# Altium project OPENMV4_wd.PrjPcb
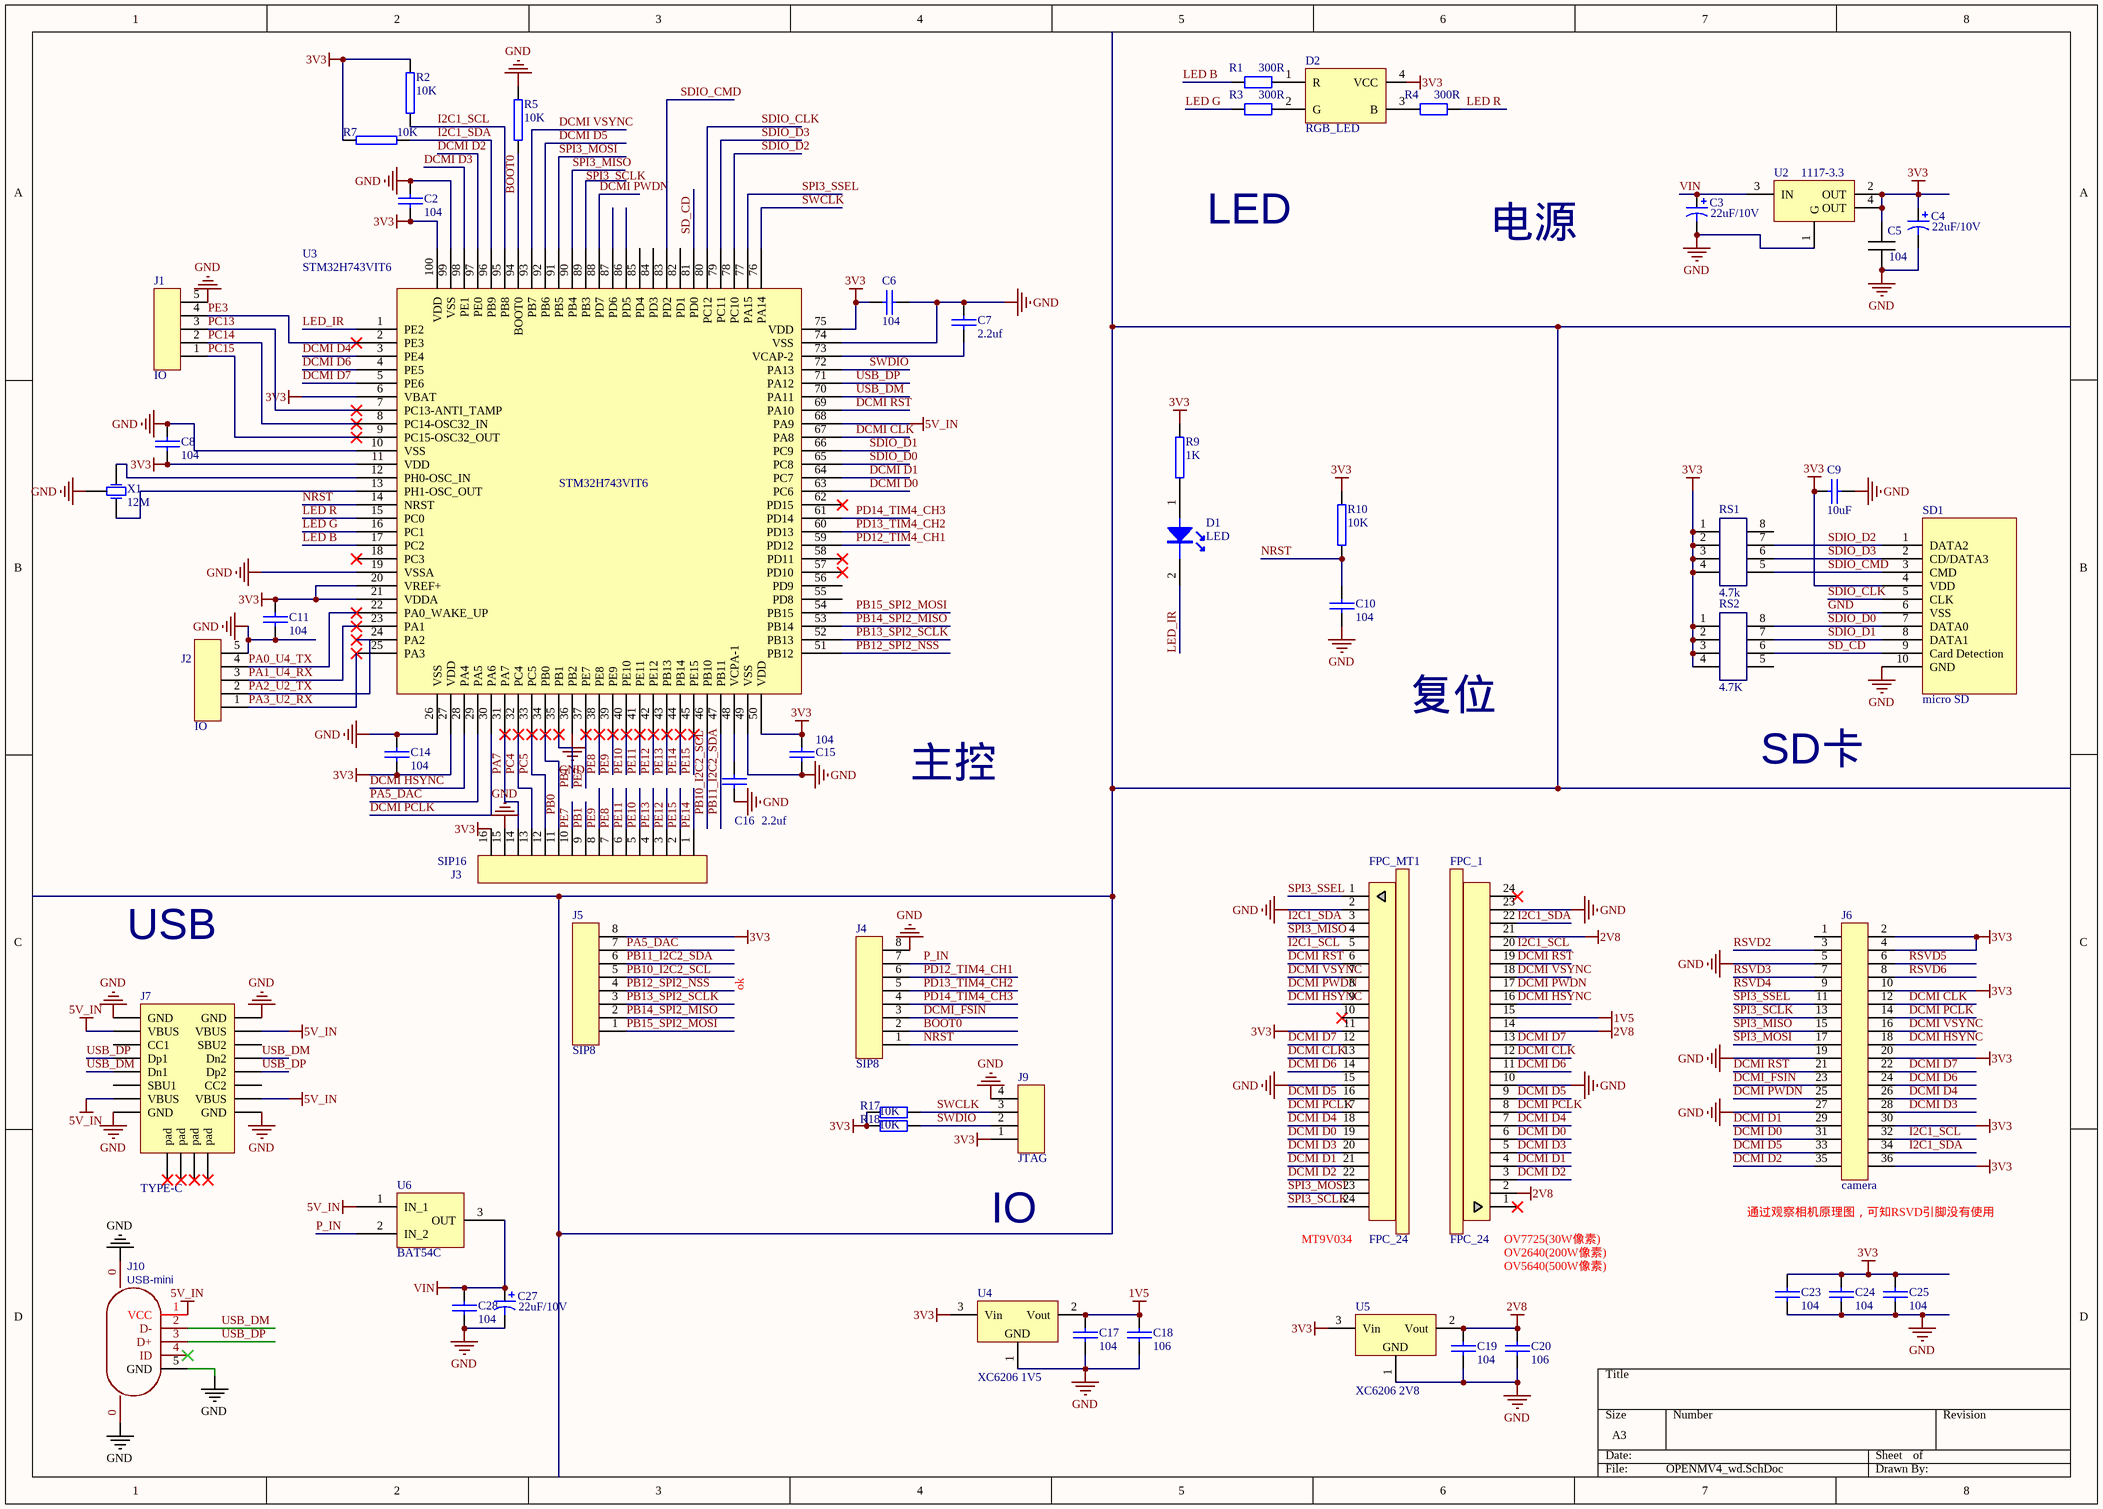
[diagram p0: OPENMV4_wd.SchDoc]
1 sheet, 54 parts. Net scope: global (net labels, ports and power ports of the same name join across sheets).
Board file: openmv4_wd.PcbDoc

## Sheet OPENMV4_wd.SchDoc
size A3

### Parts
C2  104  [0805C]
C3  value 22uF/10V  [1210]  (hidden comment: 47uF)
C4  value 22uF/10V  [1210]  (hidden comment: 47uF)
C5  104  [0805C]
C6  104  [0805C]
C7  2.2uf  [0805C]
C8  104  [0805C]
C9  10uF  [LC-0805_C]
C10  104  [0805C]
C11  104  [0805C]
C14  104  [0805C]
C15  104  [0805C]
C16  2.2uf  [0805C]
C17  104  [0805C]
C18  106  [0805C]
C19  104  [0805C]
C20  106  [0805C]
C23  104  [0805C]
C24  104  [0805C]
C25  104  [0805C]
C27  value 22uF/10V  [1210]  (hidden comment: 47uF)
C28  104  [0805C]
D1  LED  [0805D]
D2  RGB_LED  [LED_3528_RGB]
FPC_1  FPC_24  [FPC_24]
FPC_MT1  FPC_24  [FPC_24]
J1  IO  [SIP5]
J2  IO  [SIP5]
J3  SIP16  [IDC16]
J4  SIP8  [sip8]
J5  SIP8  [sip8]
J6  camera  [DF12-36-DS]
J7  TYPE-C  [USB Type-C-16Pin_A]
J9  JTAG  [SIP4-1]
J10  USB-mini  [USB-MINI]
R1  value 300R  [0805R]  (hidden comment: 1K)
R2  10K  [0805R]
R3  value 300R  [0805R]  (hidden comment: 1K)
R4  value 300R  [0805R]  (hidden comment: 1K)
R5  10K  [0805R]
R7  10K  [0805R]
R9  1K  [0805R]
R10  10K  [0805R]
R17  10K  [0805R]
R18  10K  [0805R]
RS1  4.7k  [0603*4]
RS2  4.7K  [0603*4]
SD1  micro SD  [TF卡座]
U2  1117-3.3  [SOT223]
U3  STM32H743VIT6  [LQFP100 14x14_N]
U4  XC6206 1V5  [SOT23-3N]
U5  XC6206 2V8  [SOT23-3N]
U6  BAT54C  [SOT23-3N]
X1  12M  [XTAL-3215-3P]

### Nets
1V5: C17.1 C18.1 FPC_1.15 U4.2(Vout)
2V8: C19.1 C20.1 FPC_1.2 FPC_1.14 FPC_1.21 U5.2(Vout)
3V3: C2.2 C4.1 C5.2 C6.2 C8.2 C9.2 C11.1 C14.2 C15.2 C23.1 C24.1 C25.1 D2.4(VCC) FPC_MT1.11 J3.16 J5.8 J6.2 J6.4 J6.10 J6.20 J6.30 J6.36 J9.1 R2.2 R7.1 R9.1 R10.1 R17.2 R18.2 RS1.1 RS1.2 RS1.3 RS1.4 RS2.1 RS2.2 RS2.3 RS2.4 SD1.4(VDD) U2.2(OUT) U2.4(OUT) U3.6(VBAT) U3.11(VDD) U3.20(VREF+) U3.21(VDDA) U3.27(VDD) U3.50(VDD) U3.75(VDD) U3.100(VDD) U4.3(Vin) U5.3(Vin)
5V_IN: J7.A4(VBUS) J7.A9(VBUS) J7.B4(VBUS) J7.B9(VBUS) J10.1(VCC) U3.68(PA9) U6.1(IN_1)
GND: C2.1 C3.2 C4.2 C5.1 C6.1 C7.2 C8.1 C9.1 C10.1 C11.2 C14.1 C15.1 C16.2 C17.2 C18.2 C19.2 C20.2 C23.2 C24.2 C25.2 C27.2 C28.2 FPC_1.10 FPC_1.23 FPC_MT1.2 FPC_MT1.15 J1.5 J2.5 J3.15 J4.8 J6.5 J6.19 J6.27 J7.A1(GND) J7.A12(GND) J7.B1(GND) J7.B12(GND) J9.4 J10.0(SH4) J10.5(GND) R5.2 SD1.6(VSS) SD1.10(GND) U2.1(G) U3.10(VSS) U3.19(VSSA) U3.26(VSS) U3.36(PB2) U3.49(VSS) U3.74(VSS) U3.99(VSS) U4.1(GND) U5.1(GND) X1.2
VIN: C3.1 C27.1 C28.1 U2.3(IN) U6.3(OUT)
BOOT0: J4.2 R5.1 U3.94(BOOT0)
DCMI CLK: FPC_1.12 FPC_MT1.13 J6.12 U3.67(PA8)
DCMI D0: FPC_1.6 FPC_MT1.19 J6.31 U3.63(PC6)
DCMI D1: FPC_1.4 FPC_MT1.21 J6.29 U3.64(PC7)
DCMI D2: FPC_1.3 FPC_MT1.22 J6.35 U3.97(PE0)
DCMI D3: FPC_1.5 FPC_MT1.20 J6.28 U3.98(PE1)
DCMI D4: FPC_1.7 FPC_MT1.18 J6.26 U3.3(PE4)
DCMI D5: FPC_1.9 FPC_MT1.16 J6.33 U3.92(PB6)
DCMI D6: FPC_1.11 FPC_MT1.14 J6.24 U3.4(PE5)
DCMI D7: FPC_1.13 FPC_MT1.12 J6.22 U3.5(PE6)
DCMI HSYNC: FPC_1.16 FPC_MT1.9 J6.18 U3.28(PA4)
DCMI PCLK: FPC_1.8 FPC_MT1.17 J6.14 U3.30(PA6)
DCMI PWDN: FPC_1.17 FPC_MT1.8 J6.25 U3.88(PD7)
DCMI RST: FPC_1.19 FPC_MT1.6 J6.21 U3.69(PA10)
DCMI VSYNC: FPC_1.18 FPC_MT1.7 J6.16 U3.93(PB7)
DCMI_FSIN: J4.3 J6.23
I2C1_SCL: FPC_1.20 FPC_MT1.5 J6.32 R2.1 U3.95(PB8)
I2C1_SDA: FPC_1.22 FPC_MT1.3 J6.34 R7.2 U3.96(PB9)
LED B: R1.1 U3.17(PC2)
LED G: R3.1 U3.16(PC1)
LED R: R4.2 U3.15(PC0)
LED_IR: D1.2 U3.1(PE2)
NRST: C10.2 J4.1 R10.2 U3.14(NRST)
P_IN: J4.7 U6.2(IN_2)
PA0_U4_TX: J2.4 U3.22(PA0_WAKE_UP)
PA1_U4_RX: J2.3 U3.23(PA1)
PA2_U2_TX: J2.2 U3.24(PA2)
PA3_U2_RX: J2.1 U3.25(PA3)
PA5_DAC: J5.7 U3.29(PA5)
PA7: J3.14 U3.31(PA7)
PB0: J3.11 U3.34(PB0)
PB1: J3.9 U3.35(PB1)
PB10_I2C2_SCL: J5.5 U3.46(PB10)
PB11_I2C2_SDA: J5.6 U3.47(PB11)
PB12_SPI2_NSS: J5.4 U3.51(PB12)
PB13_SPI2_SCLK: J5.3 U3.52(PB13)
PB14_SPI2_MISO: J5.2 U3.53(PB14)
PB15_SPI2_MOSI: J5.1 U3.54(PB15)
PC4: J3.13 U3.32(PC4)
PC5: J3.12 U3.33(PC5)
PC13: J1.3 U3.7(PC13-ANTI_TAMP)
PC14: J1.2 U3.8(PC14-OSC32_IN)
PC15: J1.1 U3.9(PC15-OSC32_OUT)
PD12_TIM4_CH1: J4.6 U3.59(PD12)
PD13_TIM4_CH2: J4.5 U3.60(PD13)
PD14_TIM4_CH3: J4.4 U3.61(PD14)
PE3: J1.4 U3.2(PE3)
PE7: J3.10 U3.37(PE7)
PE8: J3.7 U3.38(PE8)
PE9: J3.8 U3.39(PE9)
PE10: J3.5 U3.40(PE10)
PE11: J3.6 U3.41(PE11)
PE12: J3.3 U3.42(PE12)
PE13: J3.4 U3.43(PB13)
PE14: J3.1 U3.44(PB14)
PE15: J3.2 U3.45(PE15)
RSVD2: J6.3
RSVD3: J6.7
RSVD4: J6.9
RSVD5: J6.6
RSVD6: J6.8
SD_CD: RS2.6 SD1.9(Card_Detection) U3.81(PD0)
SDIO_CLK: SD1.5(CLK) U3.80(PC12)
SDIO_CMD: RS1.5 SD1.3(CMD) U3.83(PD2)
SDIO_D0: RS2.8 SD1.7(DATA0) U3.65(PC8)
SDIO_D1: RS2.7 SD1.8(DATA1) U3.66(PC9)
SDIO_D2: RS1.7 SD1.1(DATA2) U3.78(PC10)
SDIO_D3: RS1.6 SD1.2(CD/DATA3) U3.79(PC11)
SPI3_MISO: FPC_MT1.4 J6.15 U3.90(PB4)
SPI3_MOSI: FPC_MT1.23 J6.17 U3.91(PB5)
SPI3_SCLK: FPC_MT1.24 J6.13 U3.89(PB3)
SPI3_SSEL: FPC_MT1.1 J6.11 U3.77(PA15)
SWCLK: J9.3 R17.1 U3.76(PA14)
SWDIO: J9.2 R18.1 U3.72(PA13)
USB_DM: J7.A7(Dn1) J7.B7(Dn2) J10.2(D-) U3.70(PA11)
USB_DP: J7.A6(Dp1) J7.B6(Dp2) J10.3(D+) U3.71(PA12)
NetC7_1: C7.1 U3.73(VCAP-2)
NetC16_1: C16.1 U3.48(VCPA-1)
NetD1_1: D1.1 R9.2
NetD2_1: D2.1(R) R1.2
NetD2_2: D2.2(G) R3.2
NetD2_3: D2.3(B) R4.1
NetU3_12: U3.12(PH0-OSC_IN) X1.1
NetU3_13: U3.13(PH1-OSC_OUT) X1.3

Not connected (* = marked no-connect by the designer): FPC_1 1* 24*; FPC_MT1 10*; J6 1; J7 0(pad)* A5(CC1) A8(SBU1) B5(CC2) B8(SBU2); J10 4(ID)*; RS1 8(24); RS2 5(21); U3 18(PC3)* 55(PD8) 56(PD9) 57(PD10)* 58(PD11)* 62(PD15)* 82(PD1) 84(PD3) 85(PD4) 86(PD5) 87(PD6)

### Notes on the sheet
- LED
- 电源
- 复位
- 主控
- SD卡
- USB
- ok
- (near J9) IO
- (near FPC_MT1) MT9V034
- (near FPC_1) OV7725(30W像素)
- (near FPC_1) OV2640(200W像素)
- (near J6) 通过观察相机原理图，可知RSVD引脚没有使用
- OV5640(500W像素)

### Library data of the parts
C2 C6-C11 C14-C20 C23-C25 C28 = CAP
C3 C4 C27 = Cap Pol1: Polarized Capacitor (Radial); Published: 8-Jun-2000; LatestRevisionDate: 17-Jul-2002; LatestRevisionNote: Re-released for DXP Platform.; PackageReference: RB7.6-15; Publisher: Altium Limited
C5 = CAP104
D2 = RGB_LED: 三色高亮LED
J1 J2 = SIP5
J6 = IDC36
J7 = USB_C
J9 = SIP4
J10 = USB-CON-MICRO-B-5S: BOM_Manufacturer: ValuePro; BOM_Supplier: LCSC; BOM_Manufacturer Part: USB-CON-MICRO-B-5S; image: //image.lceda.cn/szlcsc/C40954.jpg; BOM_Supplier Part: C40954; spicePre: U; spiceSymbolName: USB-CON-MICRO-B-5S
R1 R3 R4 R17 R18 = Res2: Resistor; Published: 8-Jun-2000; LatestRevisionDate: 17-Jul-2002; LatestRevisionNote: Re-released for DXP Platform.; PackageReference: AXIAL-0.4; Publisher: Altium Limited
  R17 R18: Value: 10K
R2 R5 R7 R9 R10 = RES
RS1 RS2 = RS
U2 = 1117
U4 U5 = XC6206P332MR: 低压差线性稳压芯片; 版权归属: 源创客; BOM名称: 低压差线性稳压芯片; 学习资源: www.ooocke.com
X1 = XTAL_3P